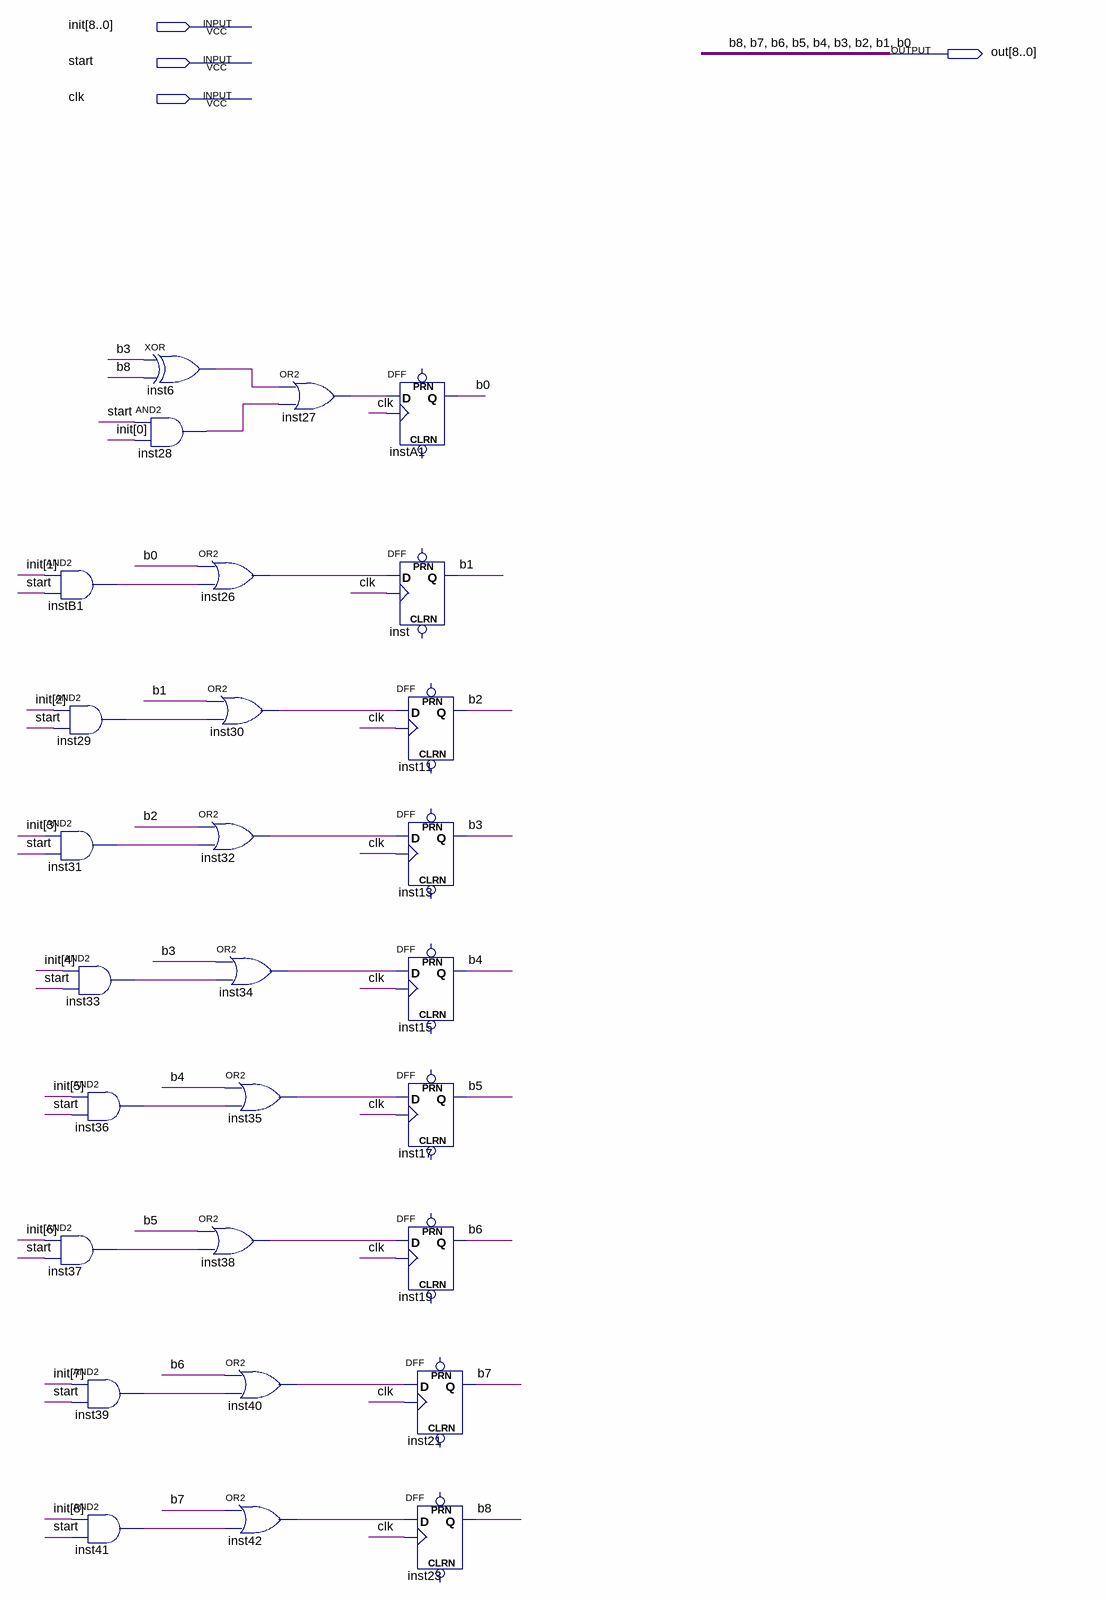
[diagram p0: schematic sheet]
// Quartus schematic PseudoSluc.bdf as structural Verilog: 28 symbols, 4 pins
module PseudoSluc (
  input  [8:0] init,
  input  start,
  input  clk,
  output [8:0] out
);

  wire inst6_out, inst26_out, inst27_out, inst28_out, inst29_out, inst30_out, inst31_out, inst32_out,
       inst33_out, inst34_out, inst35_out, inst36_out, inst37_out, inst38_out, inst39_out, inst40_out,
       inst41_out, inst42_out, instB1_out;

  and instB1 (instB1_out, init[1], start);
  and inst29 (inst29_out, init[2], start);
  and inst31 (inst31_out, init[3], start);
  and inst33 (inst33_out, init[4], start);
  and inst36 (inst36_out, init[5], start);
  and inst37 (inst37_out, init[6], start);
  and inst39 (inst39_out, init[7], start);
  and inst41 (inst41_out, init[8], start);
  xor inst6 (inst6_out, out[3], out[8]);
  and inst28 (inst28_out, start, init[0]);
  or inst26 (inst26_out, out[0], instB1_out);
  or inst30 (inst30_out, out[1], inst29_out);
  or inst32 (inst32_out, out[2], inst31_out);
  or inst34 (inst34_out, out[3], inst33_out);
  or inst35 (inst35_out, out[4], inst36_out);
  or inst38 (inst38_out, out[5], inst37_out);
  or inst40 (inst40_out, out[6], inst39_out);
  or inst42 (inst42_out, out[7], inst41_out);
  or inst27 (inst27_out, inst6_out, inst28_out);
  DFF instA1 (.CLK(clk), .D(inst27_out), .Q(out[0]));  // open: CLRN, PRN
  DFF inst (.CLK(clk), .D(inst26_out), .Q(out[1]));  // open: CLRN, PRN
  DFF inst11 (.CLK(clk), .D(inst30_out), .Q(out[2]));  // open: CLRN, PRN
  DFF inst13 (.CLK(clk), .D(inst32_out), .Q(out[3]));  // open: CLRN, PRN
  DFF inst15 (.CLK(clk), .D(inst34_out), .Q(out[4]));  // open: CLRN, PRN
  DFF inst17 (.CLK(clk), .D(inst35_out), .Q(out[5]));  // open: CLRN, PRN
  DFF inst19 (.CLK(clk), .D(inst38_out), .Q(out[6]));  // open: CLRN, PRN
  DFF inst21 (.CLK(clk), .D(inst40_out), .Q(out[7]));  // open: CLRN, PRN
  DFF inst23 (.CLK(clk), .D(inst42_out), .Q(out[8]));  // open: CLRN, PRN

  // Other names for the same wires on the sheet: b0 = out[0]; b1 = out[1]; b2 = out[2]; b3 = out[3]; b4 = out[4];
  //   b5 = out[5]; b6 = out[6]; b7 = out[7]; b8 = out[8]
endmodule
